# Altium schematic sheet Main.SchDoc
size Letter; DocumentNumber: 3; SheetNumber: 3; SheetTotal: 3
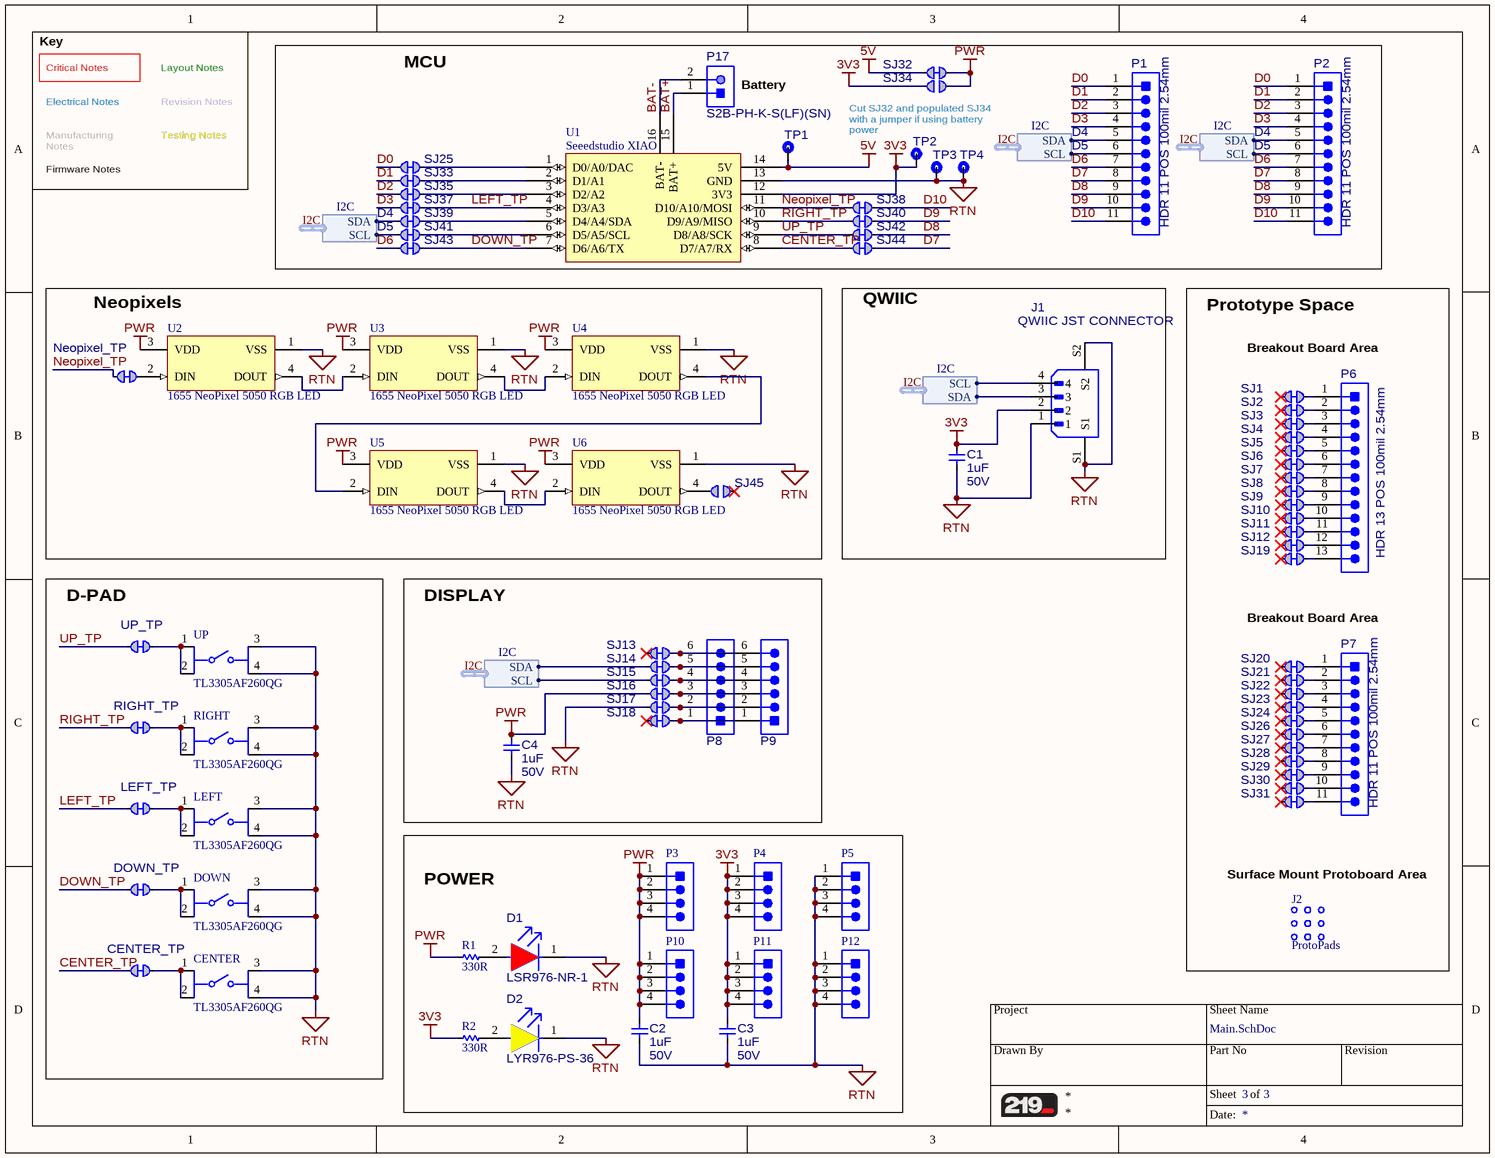
[diagram p0: Main.SchDoc]

## Parts
C1  value 1uF  Voltage Rating: 50V  [FP-GRM21B-0_15-IPC_B]  (hidden comment: Multilayer Ceramic Capacitor, 1 uF, 50 V, ± 10%, X7R, 0805)
C2  value 1uF  Voltage Rating: 50V  [FP-GRM21B-0_15-IPC_B]  (hidden comment: Multilayer Ceramic Capacitor, 1 uF, 50 V, ± 10%, X7R, 0805)
C3  value 1uF  Voltage Rating: 50V  [FP-GRM21B-0_15-IPC_B]  (hidden comment: Multilayer Ceramic Capacitor, 1 uF, 50 V, ± 10%, X7R, 0805)
C4  value 1uF  Voltage Rating: 50V  [FP-GRM21B-0_15-IPC_B]  (hidden comment: Multilayer Ceramic Capacitor, 1 uF, 50 V, ± 10%, X7R, 0805)
CENTER  TL3305AF260QG  [FP-TL3305AF260QG-MFG]
CENTER_TP  SJ CUSTOM SMD NC  [SJ CUSTOM SMD NC]  (value not drawn)  (net tie, no BOM)
D1  LSR976-NR-1  [FP-LS_R976-MFG]
D2  LYR976-PS-36  [FP-LS_R976-MFG]
DOWN  TL3305AF260QG  [FP-TL3305AF260QG-MFG]
DOWN_TP  SJ CUSTOM SMD NC  [SJ CUSTOM SMD NC]  (value not drawn)  (net tie, no BOM)
J1  QWIIC JST CONNECTOR  [SPARKFUN_PRT-14417]
J2  ProtoPads  [New footprint 1]  (no BOM)
LEFT  TL3305AF260QG  [FP-TL3305AF260QG-MFG]
LEFT_TP  SJ CUSTOM SMD NC  [SJ CUSTOM SMD NC]  (value not drawn)  (net tie, no BOM)
Neopixel_TP  SJ CUSTOM SMD NC  [SJ CUSTOM SMD NC]  (value not drawn)  (net tie, no BOM)
P1  HDR 11 POS 100mil 2.54mm  [HDR 11 POS 100mil 2.54mm no outline]  (no BOM)
P2  HDR 11 POS 100mil 2.54mm  [HDR 11 POS 100mil 2.54mm no outline]  (no BOM)
P3  HDR 04 POS 100mil 2.54mm  [HDR 04 POS 100mil 2.54mm - No Outline]  (value not drawn)  (no BOM)
P4  HDR 04 POS 100mil 2.54mm  [HDR 04 POS 100mil 2.54mm - No Outline]  (value not drawn)  (no BOM)
P5  HDR 04 POS 100mil 2.54mm  [HDR 04 POS 100mil 2.54mm - No Outline]  (value not drawn)  (no BOM)
P6  HDR 13 POS 100mil 2.54mm  [HDR 13 POS 100mil 2.54mm No Outline]  (no BOM)
P7  HDR 11 POS 100mil 2.54mm  [HDR 11 POS 100mil 2.54mm no outline]  (no BOM)
P8  HDR 06 POS 100mil 2.54mm  [HDR 06 POS 100mil 2.54mm]  (value not drawn)  (no BOM)
P9  HDR 06 POS 100mil 2.54mm  [HDR 06 POS 100mil 2.54mm]  (value not drawn)  (no BOM)
P10  HDR 04 POS 100mil 2.54mm  [HDR 04 POS 100mil 2.54mm - No Outline]  (value not drawn)  (no BOM)
P11  HDR 04 POS 100mil 2.54mm  [HDR 04 POS 100mil 2.54mm - No Outline]  (value not drawn)  (no BOM)
P12  HDR 04 POS 100mil 2.54mm  [HDR 04 POS 100mil 2.54mm - No Outline]  (value not drawn)  (no BOM)
P17  S2B-PH-K-S(LF)(SN)  [JST-S2B-PH-K-S_V]
R1  value 330R  [RESC1608X55X25NL10T15]  (hidden comment: SMD Chip Resistor, 330 Ohm, ± 1%, 100 mW, 0603)
R2  value 330R  [RESC1608X55X25NL10T15]  (hidden comment: SMD Chip Resistor, 330 Ohm, ± 1%, 100 mW, 0603)
RIGHT  TL3305AF260QG  [FP-TL3305AF260QG-MFG]
RIGHT_TP  SJ CUSTOM SMD NC  [SJ CUSTOM SMD NC]  (value not drawn)  (net tie, no BOM)
SJ1  SJ CUSTOM and TH NC  [SJ CUSTOM and TH NC]  (value not drawn)  (net tie, no BOM)
SJ2  SJ CUSTOM and TH NC  [SJ CUSTOM and TH NC]  (value not drawn)  (net tie, no BOM)
SJ3  SJ CUSTOM and TH NC  [SJ CUSTOM and TH NC]  (value not drawn)  (net tie, no BOM)
SJ4  SJ CUSTOM and TH NC  [SJ CUSTOM and TH NC]  (value not drawn)  (net tie, no BOM)
SJ5  SJ CUSTOM and TH NC  [SJ CUSTOM and TH NC]  (value not drawn)  (net tie, no BOM)
SJ6  SJ CUSTOM and TH NC  [SJ CUSTOM and TH NC]  (value not drawn)  (net tie, no BOM)
SJ7  SJ CUSTOM and TH NC  [SJ CUSTOM and TH NC]  (value not drawn)  (net tie, no BOM)
SJ8  SJ CUSTOM and TH NC  [SJ CUSTOM and TH NC]  (value not drawn)  (net tie, no BOM)
SJ9  SJ CUSTOM and TH NC  [SJ CUSTOM and TH NC]  (value not drawn)  (net tie, no BOM)
SJ10  SJ CUSTOM and TH NC  [SJ CUSTOM and TH NC]  (value not drawn)  (net tie, no BOM)
SJ11  SJ CUSTOM and TH NC  [SJ CUSTOM and TH NC]  (value not drawn)  (net tie, no BOM)
SJ12  SJ CUSTOM and TH NC  [SJ CUSTOM and TH NC]  (value not drawn)  (net tie, no BOM)
SJ13  SJ CUSTOM SMD NC  [SJ CUSTOM SMD NC]  (value not drawn)  (net tie, no BOM)
SJ14  SJ CUSTOM SMD NC  [SJ CUSTOM SMD NC]  (value not drawn)  (net tie, no BOM)
SJ15  SJ CUSTOM SMD NC  [SJ CUSTOM SMD NC]  (value not drawn)  (net tie, no BOM)
SJ16  SJ CUSTOM SMD NC  [SJ CUSTOM SMD NC]  (value not drawn)  (net tie, no BOM)
SJ17  SJ CUSTOM SMD NC  [SJ CUSTOM SMD NC]  (value not drawn)  (net tie, no BOM)
SJ18  SJ CUSTOM SMD NC  [SJ CUSTOM SMD NC]  (value not drawn)  (net tie, no BOM)
SJ19  SJ CUSTOM and TH NC  [SJ CUSTOM and TH NC]  (value not drawn)  (net tie, no BOM)
SJ20  SJ CUSTOM and TH NC  [SJ CUSTOM and TH NC]  (value not drawn)  (net tie, no BOM)
SJ21  SJ CUSTOM and TH NC  [SJ CUSTOM and TH NC]  (value not drawn)  (net tie, no BOM)
SJ22  SJ CUSTOM and TH NC  [SJ CUSTOM and TH NC]  (value not drawn)  (net tie, no BOM)
SJ23  SJ CUSTOM and TH NC  [SJ CUSTOM and TH NC]  (value not drawn)  (net tie, no BOM)
SJ24  SJ CUSTOM and TH NC  [SJ CUSTOM and TH NC]  (value not drawn)  (net tie, no BOM)
SJ25  Solder Jumper 0603 Normally Closed  [SolderJumper SPST NC 0603]  (value not drawn)  (net tie, no BOM)
SJ26  SJ CUSTOM and TH NC  [SJ CUSTOM and TH NC]  (value not drawn)  (net tie, no BOM)
SJ27  SJ CUSTOM and TH NC  [SJ CUSTOM and TH NC]  (value not drawn)  (net tie, no BOM)
SJ28  SJ CUSTOM and TH NC  [SJ CUSTOM and TH NC]  (value not drawn)  (net tie, no BOM)
SJ29  SJ CUSTOM and TH NC  [SJ CUSTOM and TH NC]  (value not drawn)  (net tie, no BOM)
SJ30  SJ CUSTOM and TH NC  [SJ CUSTOM and TH NC]  (value not drawn)  (net tie, no BOM)
SJ31  SJ CUSTOM and TH NC  [SJ CUSTOM and TH NC]  (value not drawn)  (net tie, no BOM)
SJ32  SJ CUSTOM SMD NC  [SJ CUSTOM SMD NC]  (value not drawn)  (net tie, no BOM)
SJ33  Solder Jumper 0603 Normally Closed  [SolderJumper SPST NC 0603]  (value not drawn)  (net tie, no BOM)
SJ34  SJ CUSTOM SMD NO  [SJ CUSTOM SMD NO]  (value not drawn)  (net tie, no BOM)
SJ35  Solder Jumper 0603 Normally Closed  [SolderJumper SPST NC 0603]  (value not drawn)  (net tie, no BOM)
SJ37  Solder Jumper 0603 Normally Closed  [SolderJumper SPST NC 0603]  (value not drawn)  (net tie, no BOM)
SJ38  Solder Jumper 0603 Normally Closed  [SolderJumper SPST NC 0603]  (value not drawn)  (net tie, no BOM)
SJ39  Solder Jumper 0603 Normally Closed  [SolderJumper SPST NC 0603]  (value not drawn)  (net tie, no BOM)
SJ40  Solder Jumper 0603 Normally Closed  [SolderJumper SPST NC 0603]  (value not drawn)  (net tie, no BOM)
SJ41  Solder Jumper 0603 Normally Closed  [SolderJumper SPST NC 0603]  (value not drawn)  (net tie, no BOM)
SJ42  Solder Jumper 0603 Normally Closed  [SolderJumper SPST NC 0603]  (value not drawn)  (net tie, no BOM)
SJ43  Solder Jumper 0603 Normally Closed  [SolderJumper SPST NC 0603]  (value not drawn)  (net tie, no BOM)
SJ44  Solder Jumper 0603 Normally Closed  [SolderJumper SPST NC 0603]  (value not drawn)  (net tie, no BOM)
SJ45  SJ CUSTOM SMD NO  [SJ CUSTOM SMD NO]  (value not drawn)  (net tie, no BOM)
TP1  Testpoint 35mil SMT Round  [Testpoint Round 35mil]  (value not drawn)  (no BOM)
TP2  Testpoint 35mil SMT Round  [Testpoint Round 35mil]  (value not drawn)  (no BOM)
TP3  Testpoint 35mil SMT Round  [Testpoint Round 35mil]  (value not drawn)  (no BOM)
TP4  Testpoint 35mil SMT Round  [Testpoint Round 35mil]  (value not drawn)  (no BOM)
U1  Seeedstudio XIAO  [Seeeduino XIAO-Footprint-Both]
U2  1655 NeoPixel 5050 RGB LED  [ADA-RGB-1655_V]
U3  1655 NeoPixel 5050 RGB LED  [ADA-RGB-1655_V]
U4  1655 NeoPixel 5050 RGB LED  [ADA-RGB-1655_V]
U5  1655 NeoPixel 5050 RGB LED  [ADA-RGB-1655_V]
U6  1655 NeoPixel 5050 RGB LED  [ADA-RGB-1655_V]
UP  TL3305AF260QG  [FP-TL3305AF260QG-MFG]
UP_TP  SJ CUSTOM SMD NC  [SJ CUSTOM SMD NC]  (value not drawn)  (net tie, no BOM)

## Blocks framed on the sheet
MCU: P1 P2 P17 SJ25 SJ32-SJ35 SJ37-SJ44 TP1-TP4 U1
Neopixels: Neopixel_TP SJ45 U2-U6
QWIIC: C1 J1
Prototype Space: J2 P6 P7 SJ1-SJ12 SJ19-SJ24 SJ26-SJ31
D-PAD: CENTER CENTER_TP DOWN DOWN_TP LEFT LEFT_TP RIGHT RIGHT_TP UP UP_TP
DISPLAY: C4 P8 P9 SJ13-SJ18
POWER: C2 C3 D1 D2 P3-P5 P10-P12 R1 R2

## Harnesses
I2C: SCL, SDA

## Nets
3V3: C1.1 C3.1 J1.2 P4.1 P4.2 P4.3 P4.4 P11.1 P11.2 P11.3 P11.4 R2.1 SJ34.2 TP2.1 U1.12(3V3)
5V: SJ32.1 TP1.1 U1.14(5V)
PWR: C2.1 C4.1 P3.1 P3.2 P3.3 P3.4 P10.1 P10.2 P10.3 P10.4 R1.1 SJ16.1 SJ32.2 SJ34.1 U2.3(VDD) U3.3(VDD) U4.3(VDD) U5.3(VDD) U6.3(VDD)
RTN: C1.2 C2.2 C3.2 C4.2 CENTER.3 CENTER.4 D1.1(C) D2.1(C) DOWN.3 DOWN.4 J1.1 J1.S1 J1.S2 LEFT.3 LEFT.4 P5.1 P5.2 P5.3 P5.4 P12.1 P12.2 P12.3 P12.4 RIGHT.3 RIGHT.4 SJ17.1 TP3.1 TP4.1 U1.13(GND) U2.1(VSS) U3.1(VSS) U4.1(VSS) U5.1(VSS) U6.1(VSS) UP.3 UP.4
BAT+: P17.1 U1.15(BAT+)
BAT-: P17.2 U1.16(BAT-)
CENTER_TP: CENTER_TP.1 SJ44.1 U1.8(D7/A7/RX)
D0: P1.1 P2.1 SJ25.1
D1: P1.2 P2.2 SJ33.1
D2: P1.3 P2.3 SJ35.1
D3: P1.4 P2.4 SJ37.1
D6: P1.7 P2.7 SJ43.1
D7: P1.8 P2.8 SJ44.2
D8: P1.9 P2.9 SJ42.2
D9: P1.10 P2.10 SJ40.2
D10: P1.11 P2.11 SJ38.2
DOWN_TP: DOWN_TP.1 SJ43.2 U1.7(D6/A6/TX)
I2C.SCL: J1.4 P1.6 P2.6 SJ15.1 SJ41.1 ; harness I2C.SCL
I2C.SDA: J1.3 P1.5 P2.5 SJ14.1 SJ39.1 ; harness I2C.SDA
LEFT_TP: LEFT_TP.1 SJ37.2 U1.4(D3/A3)
Neopixel_TP: Neopixel_TP.1 SJ38.1 U1.11(D10/A10/MOSI)
RIGHT_TP: RIGHT_TP.1 SJ40.1 U1.10(D9/A9/MISO)
UP_TP: SJ42.1 U1.9(D8/A8/SCK) UP_TP.1
NetCENTER_1: CENTER.1 CENTER.2 CENTER_TP.2
NetD1_2: D1.2(A) R1.2
NetD2_2: D2.2(A) R2.2
NetDOWN_1: DOWN.1 DOWN.2 DOWN_TP.2
NetLEFT_1: LEFT.1 LEFT.2 LEFT_TP.2
NetNeopixel_TP_2: Neopixel_TP.2 U2.2(DIN)
NetP6_1: P6.1 SJ1.2
NetP6_2: P6.2 SJ2.2
NetP6_3: P6.3 SJ3.2
NetP6_4: P6.4 SJ4.2
NetP6_5: P6.5 SJ5.2
NetP6_6: P6.6 SJ6.2
NetP6_7: P6.7 SJ7.2
NetP6_8: P6.8 SJ8.2
NetP6_9: P6.9 SJ9.2
NetP6_10: P6.10 SJ10.2
NetP6_11: P6.11 SJ11.2
NetP6_12: P6.12 SJ12.2
NetP6_13: P6.13 SJ19.2
NetP7_1: P7.1 SJ20.2
NetP7_2: P7.2 SJ21.2
NetP7_3: P7.3 SJ22.2
NetP7_4: P7.4 SJ23.2
NetP7_5: P7.5 SJ24.2
NetP7_6: P7.6 SJ26.2
NetP7_7: P7.7 SJ27.2
NetP7_8: P7.8 SJ28.2
NetP7_9: P7.9 SJ29.2
NetP7_10: P7.10 SJ30.2
NetP7_11: P7.11 SJ31.2
NetP8_1: P8.1 P9.1 SJ18.2
NetP8_2: P8.2 P9.2 SJ17.2
NetP8_3: P8.3 P9.3 SJ16.2
NetP8_4: P8.4 P9.4 SJ15.2
NetP8_5: P8.5 P9.5 SJ14.2
NetP8_6: P8.6 P9.6 SJ13.2
NetRIGHT_1: RIGHT.1 RIGHT.2 RIGHT_TP.2
NetSJ25_2: SJ25.2 U1.1(D0/A0/DAC)
NetSJ33_2: SJ33.2 U1.2(D1/A1)
NetSJ35_2: SJ35.2 U1.3(D2/A2)
NetSJ39_2: SJ39.2 U1.5(D4/A4/SDA)
NetSJ41_2: SJ41.2 U1.6(D5/A5/SCL)
NetSJ45_1: SJ45.1 U6.4(DOUT)
NetU2_4: U2.4(DOUT) U3.2(DIN)
NetU3_4: U3.4(DOUT) U4.2(DIN)
NetU4_4: U4.4(DOUT) U5.2(DIN)
NetU5_4: U5.4(DOUT) U6.2(DIN)
NetUP_1: UP.1 UP.2 UP_TP.2

Not connected (* = marked no-connect by the designer): SJ1 1*; SJ2 1*; SJ3 1*; SJ4 1*; SJ5 1*; SJ6 1*; SJ7 1*; SJ8 1*; SJ9 1*; SJ10 1*; SJ11 1*; SJ12 1*; SJ13 1*; SJ18 1*; SJ19 1*; SJ20 1*; SJ21 1*; SJ22 1*; SJ23 1*; SJ24 1*; SJ26 1*; SJ27 1*; SJ28 1*; SJ29 1*; SJ30 1*; SJ31 1*; SJ45 2*

## Notes on the sheet
- Key
- Critical Notes
- Layout Notes
- Battery
- Electrical Notes
- Manufacturing Notes
- Revision Notes
- Testing Notes
- (near SJ34) Cut SJ32 and populated SJ34 with a jumper if using battery power
- (near P1) D4
- (near P1) D5
- (near P2) D4
- (near P2) D5
- Firmware Notes
- D4
- D5
- Breakout Board Area
- (near J2) Surface Mount Protoboard Area
- Project
- Sheet Name
- Drawn By
- Part No
- Sheet
- of
- Revision
- Date:

## Library data of the parts
C1-C4 = CMP-001-00115-11: Multilayer Ceramic Capacitor, 1 uF, 50 V, ± 10%, X7R, 0805 [2012 Metric]; Case/Package: 0805; Max Operating Temperature: 125°C; Weight: 0.000335oz; Series: GCM; Width: 0.049inch; RoHS Compliant: Yes; Mounting Technology: Surface Mount; Dielectric: X7R; Voltage Rating (DC): 50V; Length: 0.079inch; Thickness: 0.055inch; Tolerance: 10%; Height: 1.25mm; Case Code (Imperial): 0805; Min Operating Temperature: -55°C; Termination: SMD/SMT; Packaging: Tape and Reel; Ratings: AEC-Q200; Package Quantity: 10000; Case Code (Metric): 2012
CENTER DOWN LEFT RIGHT UP = CMP-011-00020-2: Keypad Switch, 1 Switches, SPST, Momentary-tactile, 0.05A, 12VDC, 2.45N, Solder Terminal, Surface Mount-straight; RoHS Compliant: Yes
CENTER_TP DOWN_TP LEFT_TP Neopixel_TP RIGHT_TP SJ13-SJ18 SJ32 UP_TP = CMP-00056-3: Normally closed custom pad surface mount
D1 = CMP-007-00039-2: 0805 Single Color LED, Super Red, Colorless Diffused, 1.3mm; Forward Voltage: 2.5V; Pins: 2; Mounting Technology: Surface Mount; RoHS Compliant: Yes; Max Operating Temperature: 85°C; Min Operating Temperature: -30°C
D2 = CMP-007-00044-2: 0805 Single Color LED, Yellow, Colorless Diffused, 1.3mm; Forward Voltage: 2.5V; Max Operating Temperature: 85°C; Min Operating Temperature: -30°C; RoHS Compliant: Yes; Mounting Technology: Surface Mount; Pins: 2
J1 = CMP-00057-2: QWIIC JST CONNECTOR - SMD 4-PIN; MF: SparkFun Electronics; Design Item ID: PRT-14417; Package: None; SnapEDA_Link: https://www.snapeda.com/parts/PRT-14417/SparkFun+Electronics/view-part/?ref=snap; Pin Count: 4; Component Type: Standard; MP: PRT-14417; Source: PRT-14417.SchLib; Check_prices: https://www.snapeda.com/parts/PRT-14417/SparkFun+Electronics/view-part/?ref=eda; Value: *
J2 = CMP-00059-3: Soldermask defined 27 x 7 SMT Pads Array Solder Mask Defined 50 mil and 25 mil pitch 0.7mm pad
P1 P2 P7 = CMP-00053-2
P3-P5 P10-P12 = CMP-00041-2
P6 = CMP-00055-1
P8 P9 = CMP-00040-1
P17 = CMP-002-00030-3: Header for PCB; pitch 2.00mm; 2-contacts; THT; male; side entry; 100V/2A; Manufacturer: Japan Solderless Terminals; Voltage Rating (AC): 100V; Insulation Resistance: 1GR; Current Rating: 2A; Number of Positions: 2; Contact Resistance: 20mR; Pitch: 2mm; Number of Rows: 1; Reach SVHC Compliant: No; Contact Material: Brass,Tin,Bronze; Orientation: Right Angle; Housing Material: Polyamide; Termination: Solder; Package Description: Male Header, Pitch 2 mm, 1 x 2 Position, Height 4.8 mm, Tail Length 3.4 mm; Length: 5.9mm; Pins: 2; Width: 4.5mm; Contact Mating Length: 0.13inch; Height: 9.4mm; Number of Poles: 2; Series: PH; Lead Pitch: 2mm; Case/Package: S2B-PH-K-S; Min Operating Temperature: -25°C; Number of Contacts: 2; Working Voltage: 100V; Package Reference: S2B-PH-K-S; Housing Color: White; Contact Type: Male Pin; Max Voltage Rating (DC): 100V; Datasheet Version: Dec-12; Mounting Technology: Through Hole; Fastening Type: Detent; Gender: Male; Contact Plating: Tin,Copper; Packaging: Bulk; Max Operating Temperature: 85°C; Lead Free: Lead Free; Max Voltage Rating (AC): 100V; Max Current Rating: 2A; Connector Type: Header; RoHS Compliant: Unknown; Flammability Rating: UL94 V-0; Depth: 7.6mm; Color: Natural,White; Voltage Rating: 100V; Datasheet URL: http://www.jst-mfg.com/product/pdf/eng/ePH.pdf
R1 R2 = CMP-009-00273-5: SMD Chip Resistor, 330 Ohm, ± 1%, 100 mW, 0603 [1608 Metric], Thick Film, General Purpose; Power Rating: 100mW; ESR (Equivalent Series Resistance): 800mR; Voltage Rating (DC): 50V; Temperature Coefficient: 100ppm/°C; Depth: 0.8mm; Max Operating Temperature: 155°C; Resistance Tolerance: 1%; Technology: THICK FILM; Features: Moisture Resistant; Case Code (Metric): 1608; RoHS Compliant: Yes; Pins: 2; Width: 0.8mm; Reach SVHC Compliant: No; Max Power Dissipation: 100mW; Packaging: Tape and Reel; Series: RC; Voltage Rating (AC): 50V; Resistor Type: Thick Film; Number of Terminations: 2; Case/Package: 0603; Voltage Rating: 50V; Case Code (Imperial): 0603; Length: 1.6mm; Min Operating Temperature: -55°C; Package Quantity: 1; Tolerance: 1%; Lead Free: Lead Free; Height: 0.45mm; Termination: SMD/SMT
SJ1-SJ12 SJ19-SJ24 SJ26-SJ31 = CMP-00027-10: Normally closed custom pad and TH pads
SJ25 SJ33 SJ35 SJ37-SJ44 = CMP-090-000001-1: Source: Solder Jumper.SchLib; Design Item ID: Solder Jumper 0603 Normally Closed
SJ34 SJ45 = CMP-00060-2: Normally open custom pad SMD pads
TP1-TP4 = CMP-075-000017-1: Design Item ID: Testpoint 35mil SMT Round; Do Not Populate: Do Not Populate; MPN: N/A; Created By: Miguel; Source: Testpoint.SchLib; Manufacturer: N/A
U1 = CMP-00050-3: Seeed studio XIAO series dev boards
U2-U6 = CMP-007-00001-7: NeoPixel 5050 RGB LED with Integrated Driver Chip - 10 Pack; Manufacturer: Adafruit Industries; Number of LEDs: 10; Interface: Serial; Case/Package: 1655; Manufacturer URL: https://www.adafruit.com/; Min Operating Temperature: -40°C; Series: Neopixel; Max Operating Temperature: 85°C; RoHS Compliant: True; Height: 1.6mm; Package Description: 4-Pin Surface Mount Device, Body 5 x 5 mm; Datasheet Version: May-13; Datasheet URL: http://datasheet.octopart.com/ADA1655-Adafruit-Industries-datasheet-32028139.pdf; Length: 5mm; Reviewed By/Date: *; Package Reference: 1655; Mounting Technology: Surface Mount; Width: 5mm; Color: Blue,Green,Red